# Altium project UD3 Fibernet.PrjPCB
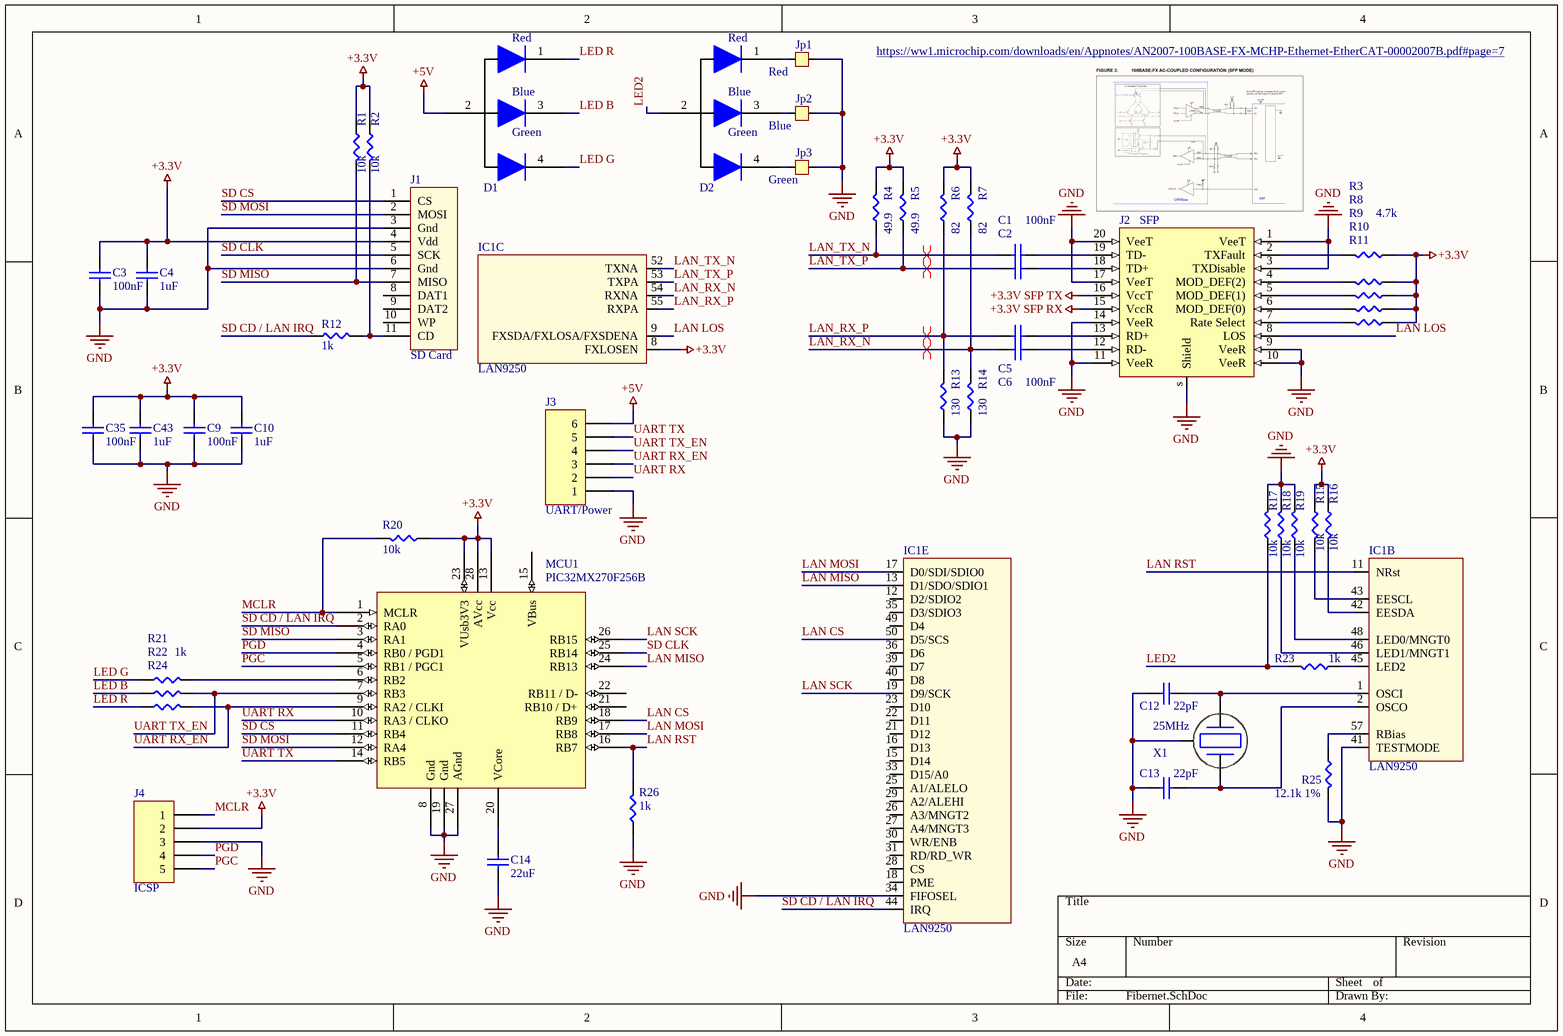
[diagram p0: Fibernet.SchDoc]
pRevision: Fibernet V2.0b
2 sheets, 94 parts. Net scope: global (net labels, ports and power ports of the same name join across sheets).
Board file: Fibernet.PcbDoc
Sheets:
  Fibernet.SchDoc
  Power Stuff.SchDoc

## Sheet Fibernet.SchDoc
size A4

### Parts
C1  100nF  [0402]
C2  100nF  [0402]  (value not drawn)
C3  100nF  [0402]
C4  1uF  [0402]
C5  100nF  [0402]
C6  100nF  [0402]  (value not drawn)
C9  100nF  [0402]
C10  1uF  [0402]
C12  22pF  [0402]
C13  22pF  [0402]
C14  22uF  [0603]
C35  100nF  [0402]
C43  1uF  [0402]
D1  RGB LED Common anode  [1411]  (value not drawn)
D2  RGB LED Common anode  [1411]  (value not drawn)
IC1  LAN9250  [QFN64]  (parts B,C,E of 5)
J1  SD Card  [MEM2075]
J2  SFP  [SFP Con and Cage]
J3  UART/Power  [HDR1X6]
J4  ICSP  [HDR1X5]
Jp1  Red  [PCB Jumper NO]
Jp2  Blue  [PCB Jumper NO]
Jp3  Green  [PCB Jumper NO]
MCU1  PIC32MX270F256B  [TSSOP28_Wide]
R1  10k  [0402]
R2  10k  [0402]
R3  4.7k  [0402]
R4  49.9  [0402]
R5  49.9  [0402]
R6  82  [0402]
R7  82  [0402]
R8  4.7k  [0402]  (value not drawn)
R9  4.7k  [0402]  (value not drawn)
R10  4.7k  [0402]  (value not drawn)
R11  4.7k  [0402]  (value not drawn)
R12  1k  [0402]
R13  130  [0402]
R14  130  [0402]
R15  10k  [0402]
R16  10k  [0402]
R17  10k  [0402]
R18  10k  [0402]
R19  10k  [0402]
R20  10k  [0402]
R21  1k  [0402]
R22  1k  [0402]  (value not drawn)
R23  1k  [0402]
R24  1k  [0402]  (value not drawn)
R25  12.1k 1%  [0402]
R26  1k  [0402]
X1  25MHz  [ECS-3225MV Oscillator]

### Nets
+3.3V: C3.2 C4.2 C9.2 C10.2 C35.2 C43.2 IC1.8(FXLOSEN) J1.4(Vdd) J4.2 MCU1.13(Vcc) MCU1.23(VUsb3V3) MCU1.28(AVcc) R1.1 R2.1 R3.2 R4.1 R5.1 R6.1 R7.1 R8.2 R9.2 R10.2 R11.2 R15.1 R16.1 R20.1
+3.3V SFP RX: J2.15(VccR)
+3.3V SFP TX: J2.16(VccT)
+5V: D1.2 J3.6
GND: C3.1 C4.1 C9.1 C10.1 C12.1 C13.1 C14.1 C35.1 C43.1 IC1.34(FIFOSEL) IC1.41(TESTMODE) J1.3(Gnd) J1.6(Gnd) J2.1(VeeT) J2.3(TXDisable) J2.9(VeeR) J2.10(VeeR) J2.11(VeeR) J2.14(VeeR) J2.17(VeeT) J2.20(VeeT) J2.s(Shield) J3.1 J4.3 Jp1.2 Jp2.2 Jp3.2 MCU1.8(Gnd) MCU1.19(Gnd) MCU1.27(AGnd) R13.2 R14.2 R17.1 R18.1 R19.1 R25.1 R26.2 X1.3(Shield)
LAN CS: IC1.50(D5/SCS) MCU1.18(RB9)
LAN LOS: IC1.9(FXSDA/FXLOSA/FXSDENA) J2.8(LOS)
LAN MISO: IC1.13(D1/SDO/SDIO1) MCU1.24(RB13)
LAN MOSI: IC1.17(D0/SDI/SDIO0) MCU1.17(RB8)
LAN RST: IC1.11(NRst) MCU1.16(RB7) R26.1
LAN SCK: IC1.19(D9/SCK) MCU1.26(RB15)
LAN_RX_N: C6.1 IC1.54(RXNA) R7.2 R14.1
LAN_RX_P: C5.1 IC1.55(RXPA) R6.2 R13.1
LAN_TX_N: C1.1 IC1.52(TXNA) R4.2
LAN_TX_P: C2.1 IC1.53(TXPA) R5.2
LED2: D2.2 R17.2 R23.1
LED B: D1.3 R22.2
LED G: D1.4 R21.2
LED R: D1.1 R24.2
MCLR: J4.1 MCU1.1(MCLR) R20.2
PGC: J4.5 MCU1.5(RB1_/_PGC1)
PGD: J4.4 MCU1.4(RB0_/_PGD1)
SD CD / LAN IRQ: IC1.44(IRQ) MCU1.2(RA0) R12.1
SD CLK: J1.5(SCK) MCU1.25(RB14)
SD CS: J1.1(CS) MCU1.11(RB4)
SD MISO: J1.7(MISO) MCU1.3(RA1) R1.2
SD MOSI: J1.2(MOSI) MCU1.12(RA4)
UART RX: J3.2 MCU1.10(RA3_/_CLKO)
UART RX_EN: J3.3 MCU1.9(RA2_/_CLKI) R24.1
UART TX: J3.5 MCU1.14(RB5)
UART TX_EN: J3.4 MCU1.7(RB3) R22.1
NetC1_2: C1.2 J2.19(TD-)
NetC2_2: C2.2 J2.18(TD+)
NetC5_2: C5.2 J2.13(RD+)
NetC6_2: C6.2 J2.12(RD-)
NetC12_2: C12.2 IC1.1(OSCI) X1.2
NetC13_2: C13.2 IC1.2(OSCO) X1.1
NetC14_2: C14.2 MCU1.20(VCore)
NetD2_1: D2.1 Jp1.1
NetD2_3: D2.3 Jp2.1
NetD2_4: D2.4 Jp3.1
NetIC1_42: IC1.42(EESDA) R16.2
NetIC1_43: IC1.43(EESCL) R15.2
NetIC1_45: IC1.45(LED2) R23.2
NetIC1_46: IC1.46(LED1/MNGT1) R18.2
NetIC1_48: IC1.48(LED0/MNGT0) R19.2
NetIC1_57: IC1.57(RBias) R25.2
NetJ1_11: J1.11(CD) R2.2 R12.2
NetJ2_2: J2.2(TXFault) R3.1
NetJ2_4: J2.4(MOD_DEF(2)) R10.1
NetJ2_5: J2.5(MOD_DEF(1)) R8.1
NetJ2_6: J2.6(MOD_DEF(0)) R9.1
NetJ2_7: J2.7(Rate_Select) R11.1
NetMCU1_6: MCU1.6(RB2) R21.1

Not connected (* = marked no-connect by the designer): IC1 12(D2/SDIO2) 15(D14) 16(D13) 18(PME) 21(D12) 22(D11) 23(D10) 25(A1/ALELO) 26(A3/MNGT2) 27(A4/MNGT3) 28(CS) 29(A2/ALEHI) 30(WR/ENB) 31(RD/RD_WR) 33(D15/A0) 35(D3/SDIO3) 36(D6) 39(D7) 40(D8) 49(D4); J1 8(DAT1) 9(DAT2) 10(WP); MCU1 15(VBus) 21(RB10_/_D+) 22(RB11_/_D-)

### Layout directives
differential pair: LAN_RX_N, LAN_RX_P, LAN_TX_N, LAN_TX_P

### Notes on the sheet
- https://ww1.microchip.com/downloads/en/Appnotes/AN2007-100BASE-FX-MCHP-Ethernet-EtherCAT-00002007B.pdf#page=7
- (in symbol RGB LED) Red; Blue; Green

### Library data of the parts
C1-C6 C9 C10 C12-C14 C35 C43 = Cap: Supplier 1: Digi-Key; Supplier 2: Digi-Key; Supplier 3: Digi-Key; Supplier Part Number 1: 1276-2044-1-ND; Supplier Part Number 2: 1276-1018-1-ND; Supplier Part Number 3: 1276-1182-1-ND; Supplier 4: Digi-Key; Supplier 5: Digi-Key; Supplier 6: Digi-Key; Supplier 7: Digi-Key; Supplier 8: Digi-Key; Supplier 9: Digi-Key; Supplier Part Number 4: 1276-1009-1-ND; Supplier Part Number 5: 1276-1098-1-ND; Supplier Part Number 6: 1276-1119-1-ND; Supplier Part Number 7: 490-12737-1-ND; Supplier Part Number 9: 587-1249-1-ND; Supplier Part Number 8: 1276-1183-1-ND; Supplier 10: Digi-Key; Supplier 11: Digi-Key; Supplier 12: Digi-Key; Supplier 13: Digi-Key; Supplier Part Number 10: 1276-CL10B104KB8NNNLCT-ND; Supplier Part Number 11: 399-1085-1-ND; Supplier Part Number 13: 587-2985-1-ND; Supplier Part Number 12: 1276-1021-1-ND; Supplier 14: Digi-Key; Supplier 15: Digi-Key; Supplier 16: Digi-Key; Supplier 17: Digi-Key; Supplier 18: Digi-Key; Supplier 19: Digi-Key; Supplier Part Number 14: 490-14603-1-ND; Supplier Part Number 15: 311-3700-1-ND; Supplier Part Number 16: 311-1042-1-ND; Supplier Part Number 17: 311-1415-1-ND; Supplier Part Number 19: 587-4321-1-ND; Supplier Part Number 18: 1276-1907-1-ND
  C1 C2 C5 C6 C9 C10 C12-C14 C35 C43: Supplier 20: Digi-Key; Supplier 21: Digi-Key; Supplier 22: Digi-Key; Supplier Part Number 20: 1276-6767-1-ND; Supplier Part Number 21: 1276-7060-1-ND; Supplier Part Number 22: 311-1084-1-ND
D1 D2 = RGB LED: RGB LED Invered; pin to pad: 1>4 2>1 4>2
IC1 = LAN9250: 10/100 Ethernet controller & PHY; ComponentLink1Description: Datasheet; ComponentLink1URL: https://ww1.microchip.com/downloads/en/DeviceDoc/00001913A.pdf; Supplier 1: Digi-Key; Supplier Part Number 1: LAN9250/ML-ND
J1 = SD Card: pin to pad: 1>2 2>3 3>6 6>none 9>none 10>none 11>9; Supplier 1: Digi-Key; Supplier Part Number 1: 609-3956-1-ND; Supplier 2: Digi-Key; Supplier Part Number 2: 2073-MEM2075-00-140-01-ACT-ND
J2 = SFP Connector: SFP Connector with cage; Supplier 1: Digi-Key; Supplier 2: Digi-Key; Supplier Part Number 1: UE75-A20-6000TCT-ND; Supplier Part Number 2: U77-A1118-200TCT-ND
J3 = Header 6: Header, 6-Pin; LatestRevisionDate: 17-Jul-2002; LatestRevisionNote: Re-released for DXP Platform.; Publisher: Altium Limited
J4 = Header 5: Header, 5-Pin; LatestRevisionDate: 17-Jul-2002; LatestRevisionNote: Re-released for DXP Platform.; Publisher: Altium Limited
Jp1-Jp3 = Jumper
MCU1 = PIC32MX2xxFxxxB: 32Bit pic with usb; Supplier 1: Digi-Key; Supplier Part Number 1: PIC32MX270F256B-I/SS-ND
R1-R26 = Resistor
X1 = Quarz crystal: pin to pad: 1>2 2>4 3>1+3; Supplier 1: Digi-Key; Supplier Part Number 1: SER4069TR-ND

## Sheet Power Stuff.SchDoc
size A4
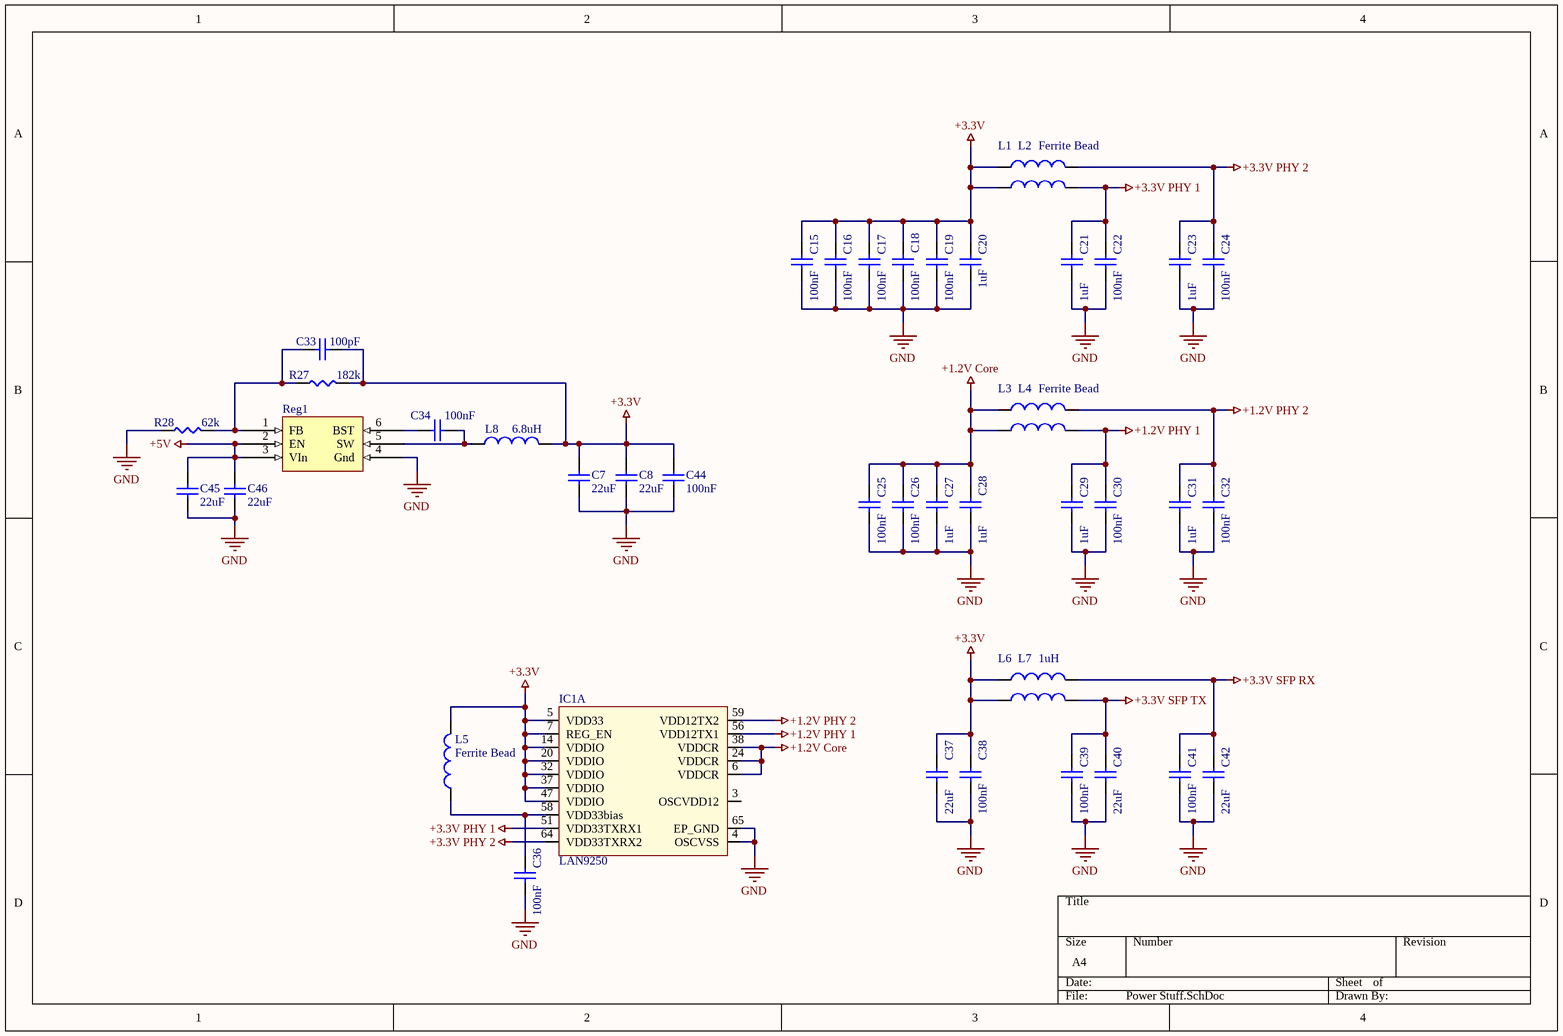
[diagram p1: Power Stuff.SchDoc]

### Parts
C7  22uF  [0603]
C8  22uF  [0603]
C15  100nF  [0402]
C16  100nF  [0402]
C17  100nF  [0402]
C18  100nF  [0402]
C19  100nF  [0402]
C20  1uF  [0402]
C21  1uF  [0402]
C22  100nF  [0402]
C23  1uF  [0402]
C24  100nF  [0402]
C25  100nF  [0402]
C26  100nF  [0402]
C27  1uF  [0402]
C28  1uF  [0402]
C29  1uF  [0402]
C30  100nF  [0402]
C31  1uF  [0402]
C32  100nF  [0402]
C33  100pF  [0402]
C34  100nF  [0402]
C36  100nF  [0402]
C37  22uF  [0603]
C38  100nF  [0402]
C39  100nF  [0402]
C40  22uF  [0603]
C41  100nF  [0402]
C42  22uF  [0603]
C44  100nF  [0402]
C45  22uF  [0603]
C46  22uF  [0603]
IC1  LAN9250  [QFN64]  (part A of 5)
L1  Ferrite Bead  [0402]
L2  Ferrite Bead  [0402]  (value not drawn)
L3  Ferrite Bead  [0402]
L4  Ferrite Bead  [0402]  (value not drawn)
L5  Ferrite Bead  [0402]
L6  1uH  [0603]
L7  1uH  [0603]  (value not drawn)
L8  6.8uH  [1008]
R27  182k  [0402]
R28  62k  [0402]
Reg1  Buck regulator  [TSOT26]  (value not drawn)

### Nets
+1.2V Core: C25.1 C26.1 C27.1 C28.1 IC1.6(VDDCR) IC1.24(VDDCR) IC1.38(VDDCR) L3.1 L4.1
+1.2V PHY 1: C29.1 C30.1 IC1.56(VDD12TX1) L4.2
+1.2V PHY 2: C31.1 C32.1 IC1.59(VDD12TX2) L3.2
+3.3V: C7.1 C8.1 C15.1 C16.1 C17.1 C18.1 C19.1 C20.1 C33.1 C37.1 C38.1 C44.1 IC1.5(VDD33) IC1.7(REG_EN) IC1.14(VDDIO) IC1.20(VDDIO) IC1.32(VDDIO) IC1.37(VDDIO) IC1.47(VDDIO) L1.1 L2.1 L5.2 L6.1 L7.1 L8.2 R27.2
+3.3V PHY 1: C21.1 C22.1 IC1.51(VDD33TXRX1) L2.2
+3.3V PHY 2: C23.1 C24.1 IC1.64(VDD33TXRX2) L1.2
+3.3V SFP RX: C41.1 C42.1 L6.2
+3.3V SFP TX: C39.1 C40.1 L7.2
+5V: C45.2 C46.1 Reg1.2(EN) Reg1.3(VIn)
GND: C7.2 C8.2 C15.2 C16.2 C17.2 C18.2 C19.2 C20.2 C21.2 C22.2 C23.2 C24.2 C25.2 C26.2 C27.2 C28.2 C29.2 C30.2 C31.2 C32.2 C36.2 C37.2 C38.2 C39.2 C40.2 C41.2 C42.2 C44.2 C45.1 C46.2 IC1.4(OSCVSS) IC1.65(EP_GND) R28.1 Reg1.4(Gnd)
NetC33_2: C33.2 R27.1 R28.2 Reg1.1(FB)
NetC34_1: C34.1 Reg1.6(BST)
NetC34_2: C34.2 L8.1 Reg1.5(SW)
NetC36_1: C36.1 IC1.58(VDD33bias) L5.1

Not connected (* = marked no-connect by the designer): IC1 3(OSCVDD12)

### Library data of the parts
C7 C8 C15-C34 C36-C42 C44-C46 = Cap: Supplier 1: Digi-Key; Supplier 2: Digi-Key; Supplier 3: Digi-Key; Supplier Part Number 1: 1276-2044-1-ND; Supplier Part Number 2: 1276-1018-1-ND; Supplier Part Number 3: 1276-1182-1-ND; Supplier 4: Digi-Key; Supplier 5: Digi-Key; Supplier 6: Digi-Key; Supplier 7: Digi-Key; Supplier 8: Digi-Key; Supplier 9: Digi-Key; Supplier Part Number 4: 1276-1009-1-ND; Supplier Part Number 5: 1276-1098-1-ND; Supplier Part Number 6: 1276-1119-1-ND; Supplier Part Number 7: 490-12737-1-ND; Supplier Part Number 9: 587-1249-1-ND; Supplier Part Number 8: 1276-1183-1-ND; Supplier 10: Digi-Key; Supplier 11: Digi-Key; Supplier 12: Digi-Key; Supplier 13: Digi-Key; Supplier Part Number 10: 1276-CL10B104KB8NNNLCT-ND; Supplier Part Number 11: 399-1085-1-ND; Supplier Part Number 13: 587-2985-1-ND; Supplier Part Number 12: 1276-1021-1-ND; Supplier 14: Digi-Key; Supplier 15: Digi-Key; Supplier 16: Digi-Key; Supplier 17: Digi-Key; Supplier 18: Digi-Key; Supplier 19: Digi-Key; Supplier Part Number 14: 490-14603-1-ND; Supplier Part Number 15: 311-3700-1-ND; Supplier Part Number 16: 311-1042-1-ND; Supplier Part Number 17: 311-1415-1-ND; Supplier Part Number 19: 587-4321-1-ND; Supplier Part Number 18: 1276-1907-1-ND; Supplier 20: Digi-Key; Supplier 21: Digi-Key; Supplier 22: Digi-Key; Supplier Part Number 20: 1276-6767-1-ND; Supplier Part Number 21: 1276-7060-1-ND; Supplier Part Number 22: 311-1084-1-ND
IC1 = LAN9250: 10/100 Ethernet controller & PHY; ComponentLink1Description: Datasheet; ComponentLink1URL: https://ww1.microchip.com/downloads/en/DeviceDoc/00001913A.pdf; Supplier 1: Digi-Key; Supplier Part Number 1: LAN9250/ML-ND
L1-L8 = Inductor: Supplier 1: Digi-Key; Supplier 2: Digi-Key; Supplier Part Number 1: 541-1250-1-ND; Supplier Part Number 2: 541-1253-1-ND; Supplier 3: Digi-Key; Supplier 4: Digi-Key; Supplier Part Number 3: SRN6028-3R9MCT-ND; Supplier Part Number 4: SRN6028-4R7MCT-ND; Supplier 5: Digi-Key; Supplier Part Number 5: 490-10563-1-ND; Supplier 6: Digi-Key; Supplier 7: Digi-Key; Supplier 8: Digi-Key; Supplier 9: Digi-Key; Supplier Part Number 6: 1276-6932-1-ND; Supplier Part Number 7: 587-2042-1-ND; Supplier Part Number 9: SRP1265A-1R0MCT-ND; Supplier Part Number 8: 535-12790-1-ND; Supplier 10: Digi-Key; Supplier Part Number 10: SRP1770TA-5R6MCT-ND; Supplier 11: Digi-Key; Supplier Part Number 11: SRN6028-100MCT-ND
  L1-L7: Supplier 12: Digi-Key; Supplier Part Number 12: SRN2510F-2R2MCT-ND; Supplier 13: Digi-Key; Supplier Part Number 13: 490-3992-1-ND
R27 R28 = Resistor
Reg1 = AP6320: Supplier 1: Digi-Key; Supplier Part Number 1: AP63203WU-7DICT-ND; Supplier 2: Digi-Key; Supplier Part Number 2: AP63200WU-7DICT-ND; Supplier 3: Digi-Key; Supplier Part Number 3: AP63201WU-7DICT-ND

## Nets that join several sheets
+3.3V: Fibernet (26 pins), Power Stuff (26 pins)
+3.3V SFP RX: Fibernet (J2.15), Power Stuff (C41.1 C42.1 L6.2)
+3.3V SFP TX: Fibernet (J2.16), Power Stuff (C39.1 C40.1 L7.2)
+5V: Fibernet (D1.2 J3.6), Power Stuff (C45.2 C46.1 Reg1.2 Reg1.3)
GND: Fibernet (38 pins), Power Stuff (34 pins)